# Altium schematic sheet Connector.SchDoc
size 431 x 279 mm; SheetNumber: 2; SheetTotal: 8
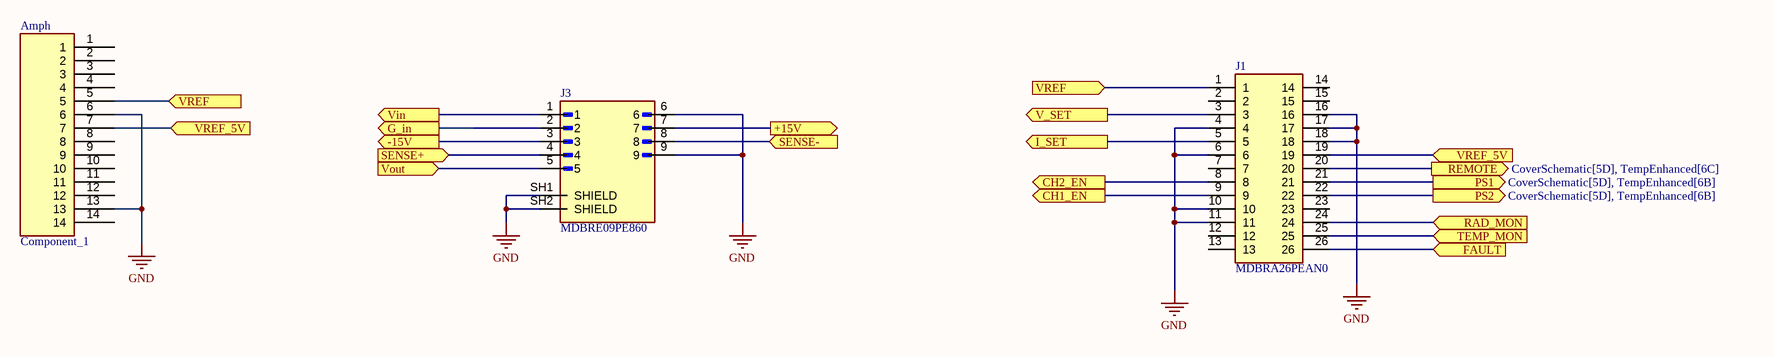
[diagram p0: Connector.SchDoc]

## Parts
Amph  Component_1  [PCBComponent_1]
J1  MDBRA26PEAN0  [MDBRA26PEAN0]
J3  MDBRE09PE860  [AMPHENOL_MDBRE09PE860]

## Ports
+15V (out, see CoverSchematic[6F]), -15V (out, see CoverSchematic[6F]), CH1_EN (out, see CoverSchematic[5E]), CH2_EN (out, see CoverSchematic[5E]), FAULT (in, see CoverSchematic[5D]), G_in (out, see CoverSchematic[5F], PassElement[10D]), I_SET (out, see CoverSchematic[5E]), PS1 (out, see CoverSchematic[5D], TempEnhanced[6B]), PS2 (out, see CoverSchematic[5D], TempEnhanced[6B]), RAD_MON (in, see CoverSchematic[5D]), REMOTE (out, see CoverSchematic[5D], TempEnhanced[6C]), SENSE+ (in, see CoverSchematic[5E], TempEnhanced[8D]), SENSE- (in, see CoverSchematic[5E], TempEnhanced[8D]), TEMP_MON (in, see CoverSchematic[5D], TemperatureMon[4E]), V_SET (out, see CoverSchematic[5E]), Vin (out, see CoverSchematic[5F], PassElement[10E]), Vout (in, see CoverSchematic[5F], TempEnhanced[5C]), VREF (in, see CoverSchematic[5D]), VREF_5V (in, see CoverSchematic[5D])

## Nets
GND: Amph.6 Amph.13 J1.4 J1.6 J1.10 J1.11 J1.16 J1.17 J1.18 J3.6 J3.9 J3.SH1(SHIELD) J3.SH2(SHIELD)
+15V: J3.7 ; port +15V
-15V: J3.3 ; port -15V
CH1_EN: J1.9 ; port CH1_EN
CH2_EN: J1.8 ; port CH2_EN
FAULT: J1.26 ; port FAULT
G_in: J3.2 ; port G_in
I_SET: J1.5 ; port I_SET
PS1: J1.21 ; port PS1
PS2: J1.22 ; port PS2
RAD_MON: J1.24 ; port RAD_MON
REMOTE: J1.20 ; port REMOTE
SENSE+: J3.4 ; port SENSE+
SENSE-: J3.8 ; port SENSE-
TEMP_MON: J1.25 ; port TEMP_MON
V_SET: J1.3 ; port V_SET
Vin: J3.1 ; port Vin
Vout: J3.5 ; port Vout
VREF: Amph.5 J1.1 ; port VREF
VREF_5V: Amph.7 J1.19 ; port VREF_5V

Not connected (* = marked no-connect by the designer): Amph 1 2 3 4 8 9 10 11 12 14; J1 2 7 12 13 14 15 23

## Notes on the sheet
- DWG. NO.
- REV.
- SHT.
- THIS DOCUMENT AND THE DATA DISCLOSED HEREIN OR HEREWITH IS THE PROPERTY OF ALTIUM LIMITED AND MAY BE FREELY DISTRIBUTED IN WHOLE. NO RIGHTS ARE RESERVED OR EXPRESS OR IMPLIED WARANTEE GIVEN.
- REVISION
- DESCRIPTION
- DATE
- APPROVED
- TITLE
- PROJECT
- SCALE:
- B
- SIZE
- CAGE CODE
- FILE NAME
- DWG by:
- Heitor Sampaio Mendes
- SHEET
- OF
- REV

## Library data of the parts
Amph = ACRK-16-01-G-T-B1-M-1
J1 = MDBRA26PEAN0: Connector; Manufacturer_Name: Amphenol Communications Solutions; Datasheet Link: https://cdn.amphenol-cs.com/media/wysiwyg/files/documentation/datasheet/inputoutput/io_harsh_mdbr.pdf; Height: 15.18mm; Manufacturer_Part_Number: MDBRA26PEAN0; Mouser Part Number: 523-MDBRA26PEAN0; Mouser Price/Stock: https://www.mouser.co.uk/ProductDetail/Amphenol-Commercial-Products/MDBRA26PEAN0?qs=ToP8pWlZ0bMfgHuNRziKHA%3D%3D
J3 = MDBRE09PE860: MF: {'manufacturer': u'Amphenol Commercial Products'}; Package: None; Price: None; Value: *; MP: MDBRE09PE860; Availability: Unavailable